# Altium schematic sheet 181031 Schematic.SchDoc
size A
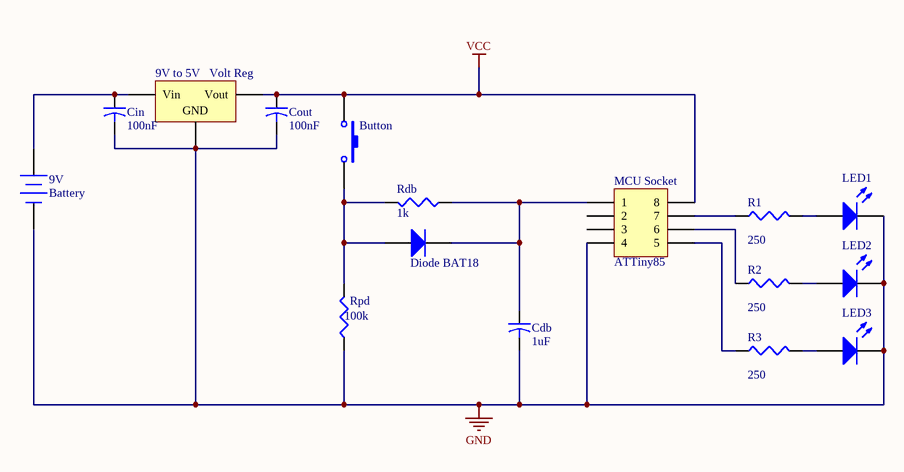
[diagram p0: 181031 Schematic.SchDoc]

## Parts
9V  Battery  [BAT-2]
9V_to_5V  Volt Reg  [D2PAK_N]
Button  (no value)  [SPST-2]
Cdb  value 1uF  [CAPR5-4X5]
Cin  value 100nF  [CAPR5-4X5]  (hidden comment: Cap2)
Cout  value 100nF  [CAPR5-4X5]  (hidden comment: 10pF)
D  Diode BAT18  [SOT-23_N]
LED1  1  [LED-1]  (value not drawn)
LED2  LED1  [LED-1]  (value not drawn)
LED3  LED1  [LED-1]  (value not drawn)
MCU_Socket  ATTiny85  [HDR2X4_CEN]
R1  250  [J1-0603]
R2  value 250  [J1-0603]
R3  value 250  [J1-0603]
Rdb  value 1k  [J1-0603]  (hidden comment: Debounce)
Rpd  value 100k  [J1-0603]

## Nets
GND: 9V.2(-) 9V_to_5V.2(GND) Cdb.2 Cin.2 Cout.2 LED1.2(K) LED2.2(K) LED3.2(K) MCU_Socket.4 Rpd.1
VCC: 9V_to_5V.3(Vout) Button.1 Cout.1 MCU_Socket.5(8)
Net9V_1: 9V.1(+) 9V_to_5V.1(Vin) Cin.1
NetButton_2: Button.2 D.1(A) Rdb.2 Rpd.2
NetCdb_1: Cdb.1 D.3(K) MCU_Socket.1 Rdb.1
NetLED1_1: LED1.1(A) R1.2
NetLED2_1: LED2.1(A) R2.2
NetLED3_1: LED3.1(A) R3.2
NetMCU_Socket_6: MCU_Socket.6(7) R1.1
NetMCU_Socket_7: MCU_Socket.7(6) R2.1
NetMCU_Socket_8: MCU_Socket.8(5) R3.1

Not connected (* = marked no-connect by the designer): MCU_Socket 2 3

## Library data of the parts
9V = Battery: Multicell Battery; Published: 24-Mar-1999; LatestRevisionDate: 17-Jul-2002; LatestRevisionNote: Re-released for DXP Platform.; PackageReference: BAT-2; Publisher: Altium Limited; PackageDescription: Battery; 2 Leads
9V_to_5V = Volt Reg: Voltage Regulator; Published: 24-Mar-1999; LatestRevisionDate: 29-May-2009; LatestRevisionNote: IPC-7351 Footprint Added.; PackageReference: D2PAK; Publisher: Altium Limited; PackageDescription: 3-Pin Transistor Outline Package 2.54 mm Pitch, 15.1 mm Lead Span
Button = SW-PB: Switch; Published: 24-Mar-1999; LatestRevisionDate: 17-Jul-2002; LatestRevisionNote: Re-released for DXP Platform.; PackageReference: SPST-2; Publisher: Altium Limited; PackageDescription: Switch; 2 Leads
Cdb Cin Cout = Cap2: Capacitor; Published: 23-Sep-2002; PackageReference: CAPR5-4X5; Publisher: Altium Limited; PackageDescription: Capacitor; 2 Leads
D = Diode BAT18: Low-Loss RF Switching Diode; Note: Pin 2 is not connected and not drawn.; Published: 21-Mar-2003; LatestRevisionDate: 29-May-2009; LatestRevisionNote: IPC-7351 Footprint Added.; DatasheetVersion: Oct-1999; PackageVersion: Sep-2001; PackageReference: SOT-23; Publisher: Altium Limited; PackageDescription: 3-Pin SOT-23 Package 0.95 mm Pitch, 2.5 mm Lead Span; ComponentLink1Description: Manufacturer Link; ComponentLink1URL: http://www.infineon.com/
LED1-LED3 = LED1: Typical RED GaAs LED; Published: 8-Jun-2000; LatestRevisionDate: 08-Jul-2005; LatestRevisionNote: Mech Layer 1 removed.; PackageReference: LED-1; Publisher: Altium Limited; PackageDescription: LED; 2 Leads
MCU_Socket = Header 4X2A: Header, 4-Pin, Dual row; LatestRevisionDate: 17-Jul-2002; LatestRevisionNote: Re-released for DXP Platform.; Publisher: Altium Limited
R1-R3 Rdb Rpd = Res3: Resistor; Published: 8-Jun-2000; LatestRevisionDate: 29-May-2009; LatestRevisionNote: IPC-7351 Footprint Added.; PackageReference: J1-0603; Publisher: Altium Limited; PackageDescription: Chip Resistor
  R1: Value: 250